# Altium schematic sheet dsp-supply.SchDoc: DSP Supply
size A3; SheetNumber: 6; SheetTotal: 18
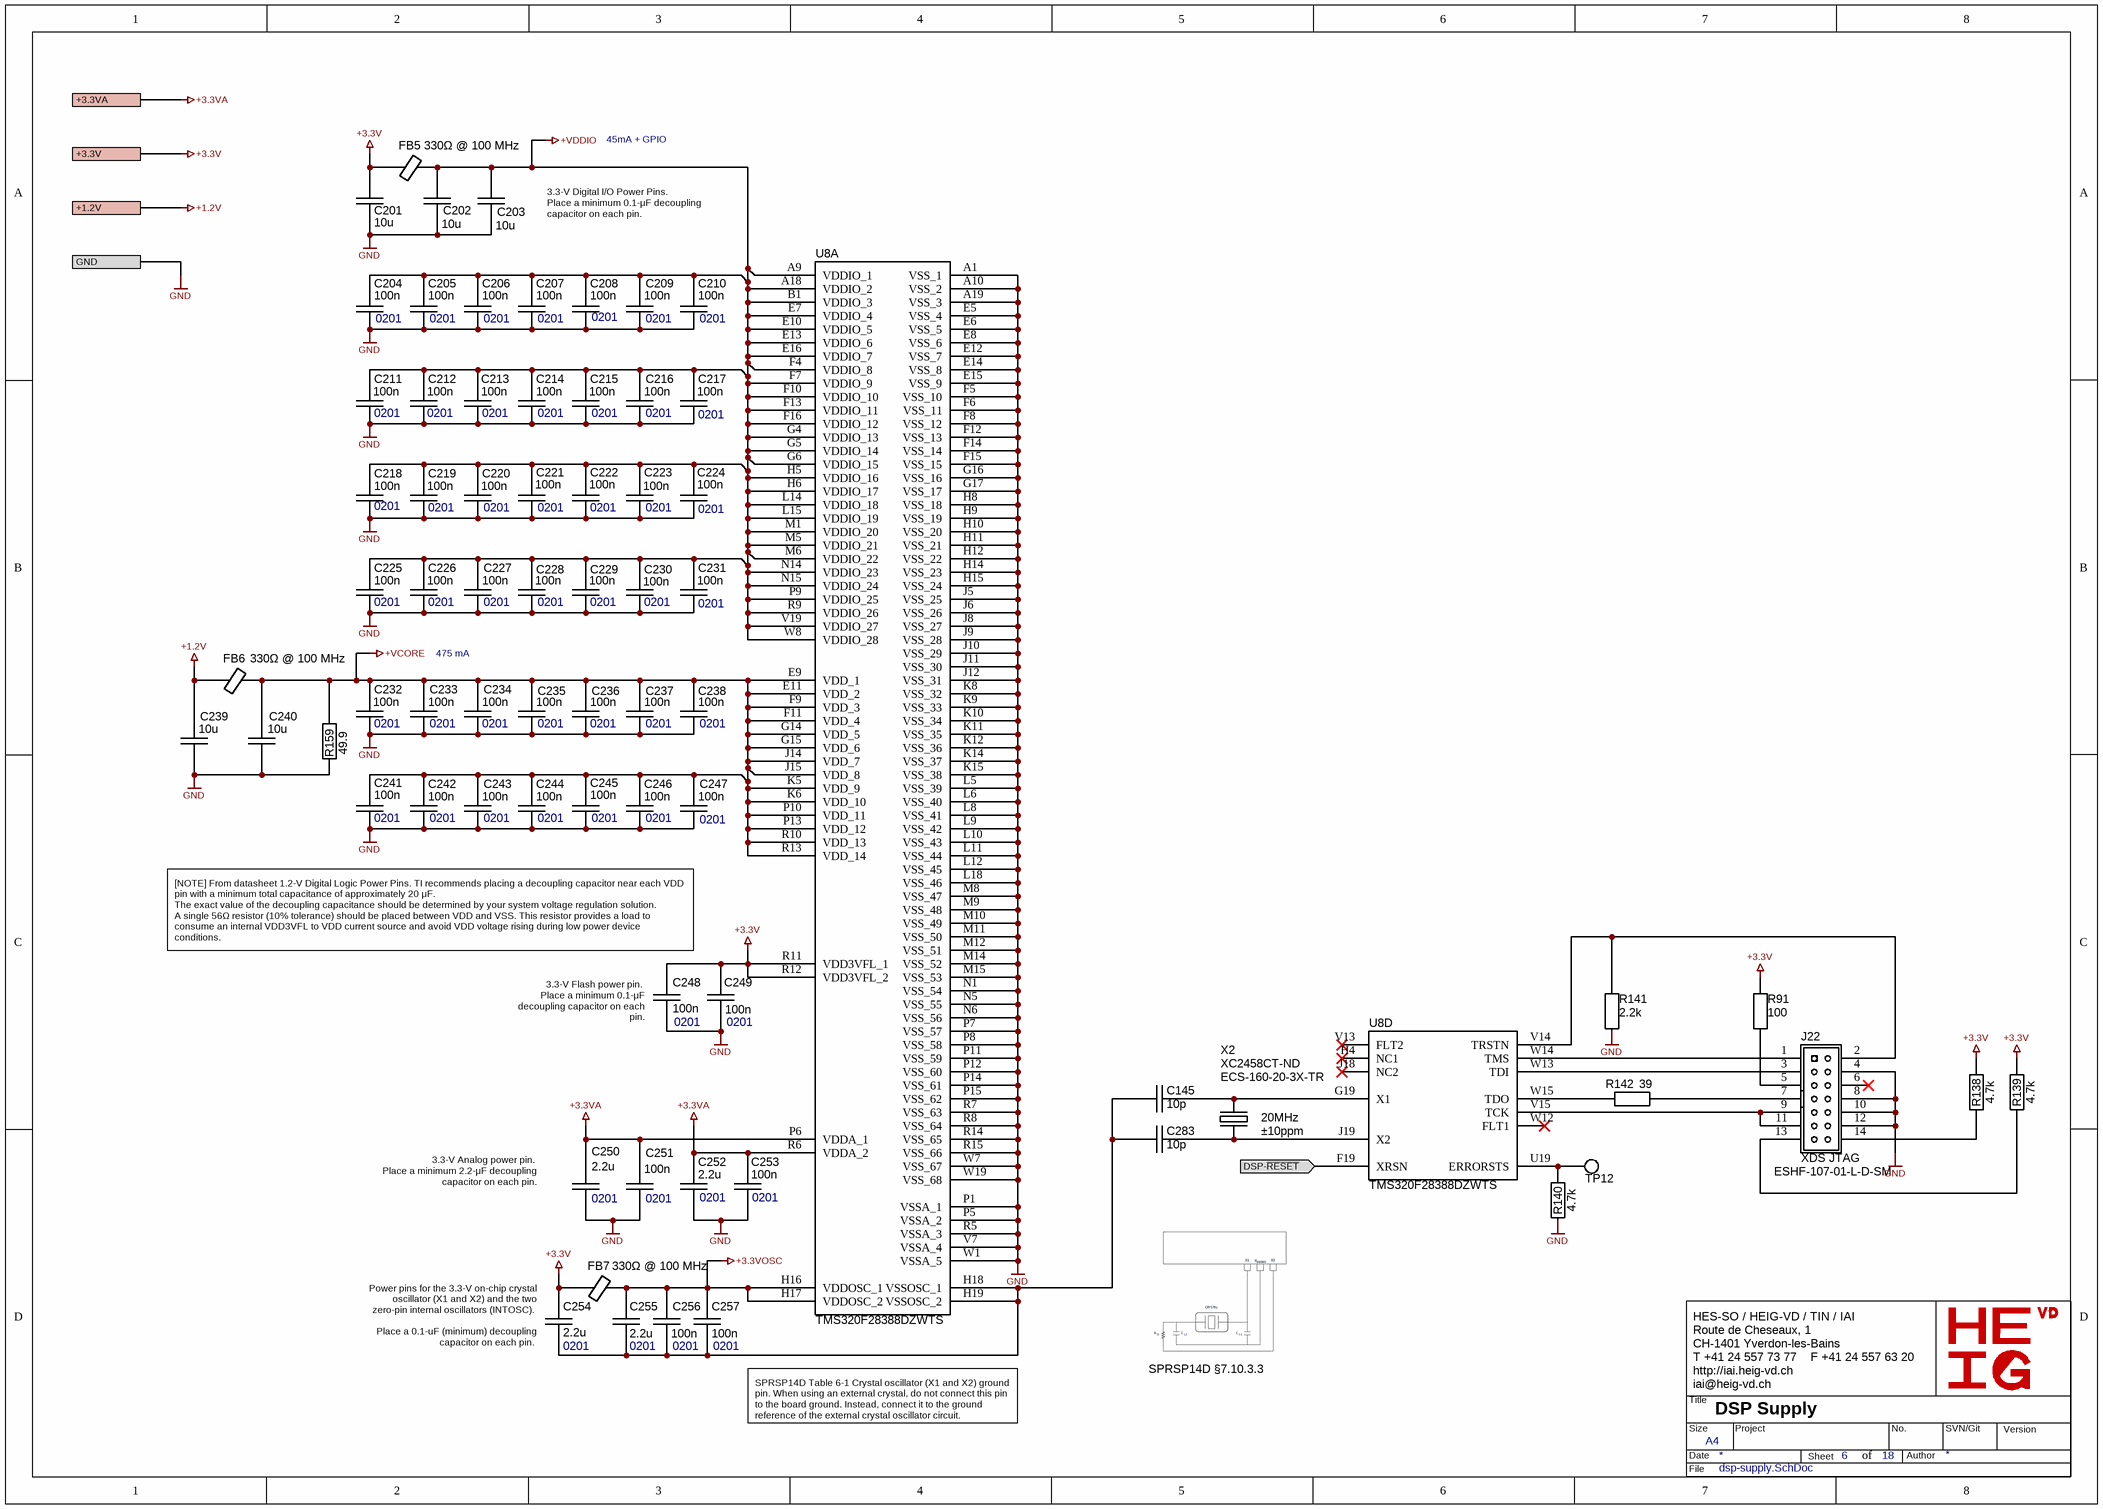
[diagram p0: dsp-supply.SchDoc]

## Parts
C145  10p  [SM/C0402]
C201  10u  [SM/C0402]
C202  10u  [SM/C0402]
C203  10u  [SM/C0402]
C204  100n  Case: 0201  [SM/C0201]
C205  100n  Case: 0201  [SM/C0201]
C206  100n  Case: 0201  [SM/C0201]
C207  100n  Case: 0201  [SM/C0201]
C208  100n  Case: 0201  [SM/C0201]
C209  100n  Case: 0201  [SM/C0201]
C210  100n  Case: 0201  [SM/C0201]
C211  100n  Case: 0201  [SM/C0201]
C212  100n  Case: 0201  [SM/C0201]
C213  100n  Case: 0201  [SM/C0201]
C214  100n  Case: 0201  [SM/C0201]
C215  100n  Case: 0201  [SM/C0201]
C216  100n  Case: 0201  [SM/C0201]
C217  100n  Case: 0201  [SM/C0201]
C218  100n  Case: 0201  [SM/C0201]
C219  100n  Case: 0201  [SM/C0201]
C220  100n  Case: 0201  [SM/C0201]
C221  100n  Case: 0201  [SM/C0201]
C222  100n  Case: 0201  [SM/C0201]
C223  100n  Case: 0201  [SM/C0201]
C224  100n  Case: 0201  [SM/C0201]
C225  100n  Case: 0201  [SM/C0201]
C226  100n  Case: 0201  [SM/C0201]
C227  100n  Case: 0201  [SM/C0201]
C228  100n  Case: 0201  [SM/C0201]
C229  100n  Case: 0201  [SM/C0201]
C230  100n  Case: 0201  [SM/C0201]
C231  100n  Case: 0201  [SM/C0201]
C232  100n  Case: 0201  [SM/C0201]
C233  100n  Case: 0201  [SM/C0201]
C234  100n  Case: 0201  [SM/C0201]
C235  100n  Case: 0201  [SM/C0201]
C236  100n  Case: 0201  [SM/C0201]
C237  100n  Case: 0201  [SM/C0201]
C238  100n  Case: 0201  [SM/C0201]
C239  10u  [SM/C0402]
C240  10u  [SM/C0402]
C241  100n  Case: 0201  [SM/C0201]
C242  100n  Case: 0201  [SM/C0201]
C243  100n  Case: 0201  [SM/C0201]
C244  100n  Case: 0201  [SM/C0201]
C245  100n  Case: 0201  [SM/C0201]
C246  100n  Case: 0201  [SM/C0201]
C247  100n  Case: 0201  [SM/C0201]
C248  100n  Case: 0201  [SM/C0201]
C249  100n  Case: 0201  [SM/C0201]
C250  2.2u  Case: 0201  [SM/C0201]
C251  100n  Case: 0201  [SM/C0201]
C252  2.2u  Case: 0201  [SM/C0201]
C253  100n  Case: 0201  [SM/C0201]
C254  2.2u  Case: 0201  [SM/C0201]
C255  2.2u  Case: 0201  [SM/C0201]
C256  100n  Case: 0201  [SM/C0201]
C257  100n  Case: 0201  [SM/C0201]
C283  10p  [SM/C0402]
FB5  value 330Ω @ 100 MHz  [SM/L0603]  (hidden comment: BLM18KG331SN1D)
FB6  value 330Ω @ 100 MHz  [SM/L0603]  (hidden comment: BLM18KG331SN1D)
FB7  value 330Ω @ 100 MHz  [SM/L0603]  (hidden comment: BLM18KG331SN1D)
J22  ESHF-107-01-L-D-SM  Function: XDS JTAG  [SAMTEC_SHF-107-01-L-D-SM]
R91  100  [SM/R0402]
R138  4.7k  [SM/R0402]
R139  4.7k  [SM/R0402]
R140  4.7k  [SM/R0402]
R141  2.2k  [SM/R0402]
R142  39  [SM/R0402]
R159  49.9  [SM/R0402]
TP12  RCUCTE  [TP/RCUCT]  (value not drawn)
U8  TMS320F28388DZWTS  [BGA337C80P19X19_1600X1600X140]  (parts A,D of 4)
X2  ECS-160-20-3X-TR  value 20MHz  Stability: ±10ppm  Supplier Part Number 1: XC2458CT-ND

## Ports
+1.2V, +3.3V, +3.3VA, DSP-~{RESET} (in), GND

## Nets
+1.2V: C239.1 FB6.1 ; port +1.2V
+3.3V: C201.1 C248.1 C249.1 C254.1 FB5.1 FB7.1 R91.2 R138.1 R139.1 U8.R11(VDD3VFL_1) U8.R12(VDD3VFL_2) ; port +3.3V
+3.3VA: C250.1 C251.1 C252.1 C253.1 U8.P6(VDDA_1) U8.R6(VDDA_2) ; port +3.3VA
+3.3VOSC: C255.1 C256.1 C257.1 FB7.2 U8.H16(VDDOSC_1) U8.H17(VDDOSC_2)
+VCORE: C232.1 C233.1 C234.1 C235.1 C236.1 C237.1 C238.1 C240.1 C241.1 C242.1 C243.1 C244.1 C245.1 C246.1 C247.1 FB6.2 R159.1 U8.E9(VDD_1) U8.E11(VDD_2) U8.F9(VDD_3) U8.F11(VDD_4) U8.G14(VDD_5) U8.G15(VDD_6) U8.J14(VDD_7) U8.J15(VDD_8) U8.K5(VDD_9) U8.K6(VDD_10) U8.P10(VDD_11) U8.P13(VDD_12) U8.R10(VDD_13) U8.R13(VDD_14)
+VDDIO: C202.1 C203.1 C204.1 C205.1 C206.1 C207.1 C208.1 C209.1 C210.1 C211.1 C212.1 C213.1 C214.1 C215.1 C216.1 C217.1 C218.1 C219.1 C220.1 C221.1 C222.1 C223.1 C224.1 C225.1 C226.1 C227.1 C228.1 C229.1 C230.1 C231.1 FB5.2 U8.A9(VDDIO_1) U8.A18(VDDIO_2) U8.B1(VDDIO_3) U8.E7(VDDIO_4) U8.E10(VDDIO_5) U8.E13(VDDIO_6) U8.E16(VDDIO_7) U8.F4(VDDIO_8) U8.F7(VDDIO_9) U8.F10(VDDIO_10) U8.F13(VDDIO_11) U8.F16(VDDIO_12) U8.G4(VDDIO_13) U8.G5(VDDIO_14) U8.G6(VDDIO_15) U8.H5(VDDIO_16) U8.H6(VDDIO_17) U8.L14(VDDIO_18) U8.L15(VDDIO_19) U8.M1(VDDIO_20) U8.M5(VDDIO_21) U8.M6(VDDIO_22) U8.N14(VDDIO_23) U8.N15(VDDIO_24) U8.P9(VDDIO_25) U8.R9(VDDIO_26) U8.V19(VDDIO_27) U8.W8(VDDIO_28)
GND: C201.2 C202.2 C203.2 C204.2 C205.2 C206.2 C207.2 C208.2 C209.2 C210.2 C211.2 C212.2 C213.2 C214.2 C215.2 C216.2 C217.2 C218.2 C219.2 C220.2 C221.2 C222.2 C223.2 C224.2 C225.2 C226.2 C227.2 C228.2 C229.2 C230.2 C231.2 C232.2 C233.2 C234.2 C235.2 C236.2 C237.2 C238.2 C239.2 C240.2 C241.2 C242.2 C243.2 C244.2 C245.2 C246.2 C247.2 C248.2 C249.2 C250.2 C251.2 C252.2 C253.2 J22.4 J22.8 J22.10 J22.12 R140.2 R141.2 R159.2 U8.A1(VSS_1) U8.A10(VSS_2) U8.A19(VSS_3) U8.E5(VSS_4) U8.E6(VSS_5) U8.E8(VSS_6) U8.E12(VSS_7) U8.E14(VSS_8) U8.E15(VSS_9) U8.F5(VSS_10) U8.F6(VSS_11) U8.F8(VSS_12) U8.F12(VSS_13) U8.F14(VSS_14) U8.F15(VSS_15) U8.G16(VSS_16) U8.G17(VSS_17) U8.H8(VSS_18) U8.H9(VSS_19) U8.H10(VSS_20) U8.H11(VSS_21) U8.H12(VSS_22) U8.H14(VSS_23) U8.H15(VSS_24) U8.J5(VSS_25) U8.J6(VSS_26) U8.J8(VSS_27) U8.J9(VSS_28) U8.J10(VSS_29) U8.J11(VSS_30) U8.J12(VSS_31) U8.K8(VSS_32) U8.K9(VSS_33) U8.K10(VSS_34) U8.K11(VSS_35) U8.K12(VSS_36) U8.K14(VSS_37) U8.K15(VSS_38) U8.L5(VSS_39) U8.L6(VSS_40) U8.L8(VSS_41) U8.L9(VSS_42) U8.L10(VSS_43) U8.L11(VSS_44) U8.L12(VSS_45) U8.L18(VSS_46) U8.M8(VSS_47) U8.M9(VSS_48) U8.M10(VSS_49) U8.M11(VSS_50) U8.M12(VSS_51) U8.M14(VSS_52) U8.M15(VSS_53) U8.N1(VSS_54) U8.N5(VSS_55) U8.N6(VSS_56) U8.P1(VSSA_1) U8.P5(VSSA_2) U8.P7(VSS_57) U8.P8(VSS_58) U8.P11(VSS_59) U8.P12(VSS_60) U8.P14(VSS_61) U8.P15(VSS_62) U8.R5(VSSA_3) U8.R7(VSS_63) U8.R8(VSS_64) U8.R14(VSS_65) U8.R15(VSS_66) U8.V7(VSSA_4) U8.W1(VSSA_5) U8.W7(VSS_67) U8.W19(VSS_68) ; port GND
DSP-~{RESET}: U8.F19(XRSN) ; port DSP-~{RESET}
NetC145_1: C145.1 U8.G19(X1) X2.2
NetC145_2: C145.2 C254.2 C255.2 C256.2 C257.2 C283.2 U8.H18(VSSOSC_1) U8.H19(VSSOSC_2)
NetC283_1: C283.1 U8.J19(X2) X2.1
NetJ22_1: J22.1 U8.W14(TMS)
NetJ22_2: J22.2 R141.1 U8.V14(TRSTN)
NetJ22_3: J22.3 U8.W13(TDI)
NetJ22_5: J22.5 R91.1
NetJ22_7: J22.7 R142.2
NetJ22_9: J22.9 J22.11 U8.V15(TCK)
NetJ22_13: J22.13 R139.2
NetJ22_14: J22.14 R138.2
NetR140_1: R140.1 TP12.1 U8.U19(ERRORSTS)
NetR142_1: R142.1 U8.W15(TDO)

Not connected (* = marked no-connect by the designer): J22 6*; U8 H4(NC1)* J18(NC2)* V13(FLT2)* W12(FLT1)*

## Notes on the sheet
- 45mA + GPIO
- 3.3-V Digital I/O Power Pins.
  Place a minimum 0.1-μF decoupling capacitor on each pin.
- 475 mA
- [NOTE] From datasheet 1.2-V Digital Logic Power Pins. TI recommends placing a decoupling capacitor near each VDD pin with a minimum total capacitance of approximately 20 μF.
  The exact value of the decoupling capacitance should be determined by your system voltage regulation solution.
  A single 56Ω resistor (10% tolerance) should be placed between VDD and VSS. This resistor provides a load to consume an internal VDD3VFL to VDD current source and avoid VDD voltage rising during low power device
  conditions.
- (near C248) 3.3-V Flash power pin.
  Place a minimum 0.1-μF decoupling capacitor on each pin.
- (near C250) 3.3-V Analog power pin.
  Place a minimum 2.2-μF decoupling capacitor on each pin.
- (near C254) Power pins for the 3.3-V on-chip crystal oscillator (X1 and X2) and the two zero-pin internal oscillators (INTOSC).
  Place a 0.1-uF (minimum) decoupling capacitor on each pin.
- SPRSP14D §7.10.3.3
- SPRSP14D Table 6-1 Crystal oscillator (X1 and X2) ground pin. When using an external crystal, do not connect this pin to the board ground. Instead, connect it to the ground reference of the external crystal oscillator circuit.
- HES-SO / HEIG-VD / TIN / IAI
  Route de Cheseaux, 1
  CH-1401 Yverdon-les-Bains
  T +41 24 557 73 77    F +41 24 557 63 20
  http://iai.heig-vd.ch
  iai@heig-vd.ch
- Title
- Size
- Date
- A4
- Project
- Sheet
- of
- No.
- Author
- SVN/Git
- Version
- File

## Library data of the parts
C145 C283 = CAP CER 22PF 50V C0G/NPO 0402: 22 pF ±2% 50V Ceramic Capacitor C0G, NP0 0402 (1005 Metric); Dielectric: NPO; Value: 22p; Voltage: 50V
  C283: Supplier 1: Digi-Key; Supplier Part Number 1: 311-1652-1-ND
C201-C203 C239 C240 = CAP CER 10UF 6.3V X5R 0402: 10 µF ±20% 6.3V Ceramic Capacitor X5R 0402 (1005 Metric); Supplier 1: Digi-Key; Supplier Part Number 1: 490-GRM155R60J106ME05JCT-ND; Value: 10u; Voltage: 6.3V; Dielectric: X5R
C204-C238 C241-C249 C251 C253 C256 C257 = CAP CER 100NF 16V X7R 0201: 100 nF ±10% 16V Ceramic Capacitor X7R 0201 (0603 Metric); Voltage: 16V; Dielectric: X7R; Supplier 1: Digi-Key; Supplier Part Number 1: 490-GRM033Z71C104KE14DCT-ND; Value: 100n
C250 C252 C254 C255 = CAP CER 2.2UF 6.3V X5R 0201: 2.2 µF ±20% 6.3V Ceramic Capacitor X5R 0201 (0603 Metric); Voltage: 16V; Supplier 1: Digi-Key; Supplier Part Number 1: 478-KGM03CR50J225MHCT-ND; Dielectric: X5R; Value: 2.2u
FB5-FB7 = FERRITE BEAD 330 OHM 0603 1LN: 330 Ohms @ 100 MHz 1 Power Line Ferrite Bead 0603 (1608 Metric) 1.7A 80mOhm; Supplier 1: Digi-Key; Supplier Part Number 1: 490-5256-1-ND
J22 = CONN 14POS: Connector Header Surface Mount 14 position 0.050" (1.27mm); Supplier 1: Digi-Key; Supplier Part Number 1: ESHF-107-01-L-D-SM-ND
R91 = RES 100 OHM 1% 1/16W 0402: 100 Ohms ±1% 0.063W, 1/16W Chip Resistor 0402 (1005 Metric) Moisture Resistant Thick Film; Supplier 1: Digi-Key; Supplier Part Number 1: 13-RC0402FR-13100RLCT-ND; Value: 100
R138-R140 = RES 4.7K OHM 5% 1/16W 0402: 4.7 kOhms ±5% 0.063W, 1/16W Chip Resistor 0402 (1005 Metric) Moisture Resistant Thick Film; Supplier 1: Digi-Key; Supplier Part Number 1: 311-4.7KJRCT-ND; Value: 4.7k
R141 = RES 2.2K OHM 1% 1/16W 0402: 2.2 kOhms ±1% 0.063W, 1/16W Chip Resistor 0402 (1005 Metric) Moisture Resistant Thick Film; Supplier 1: Digi-Key; Supplier Part Number 1: 311-2.20KLRCT-ND; Value: 2.2k
R142 = RES 39 OHM 1% 1/16W 0402: 39 Ohms ±1% 0.063W, 1/16W Chip Resistor 0402 (1005 Metric) Moisture Resistant Thick Film; Value: 1k; Supplier 1: Digi-Key; Supplier Part Number 1: 311-1.00KLRCT-ND
R159 = RES 49.9 OHM 1% 1/16W 0402: 49.9 Ohms ±1% 0.063W, 1/16W Chip Resistor 0402 (1005 Metric) Moisture Resistant Thick Film; Supplier 1: Digi-Key; Supplier Part Number 1: 311-49.9LRCT-ND; Value: 49.9
TP12 = TP: PC Test Point Plating Surface Mount Mounting Type; Supplier 1: Digi-Key; Supplier Part Number 1: 2019-RCUCTECT-ND
U8 = TMS320F28388DZWTS: C28x C2000™ C28x Fixed-Point Microcontroller IC 32-Bit Dual-Core 200MHz 512KB (256K x 16) FLASH 337-NFBGA (16x16); Manufacturer: Texas Instruments; Datasheet Link: http://www.ti.com/lit/ds/symlink/tms320f28388d.pdf; Height: 1.4mm; Supplier 1: Mouser; Supplier Part Number 1: 595-F28388DZWTS; Manufacturer Part Number: F28388DZWTS
X2 = ECS-160-20-3X-TR: 20 MHz ±10ppm Crystal 10pF 40 Ohms 4-SMD, No Lead; Supplier 1: Digi-Key